# Altium schematic sheet rlink_eth.schdoc
size 209 x 297 mm; Scale: 1:1; DocumentType: Схема электрическая принципиальная; FirstReferrence: АБВГ.123456.001; PageSetup: Record=PageOptions|CenterHorizontal=False|CenterVertical=False|PrintScale=0.95|XCorrection=0.00|YCorrection=0.00|PrintKind=1|BorderSize=5000000|LeftOffset=0|BottomOffset=0|Orientation=1|PaperLength=1000|PaperWidth=1000|Scale=100|PaperSource=15|PrintQuality=600|MediaType=1|DitherType=10|PaperKind=A4|PrintScaleMode=1
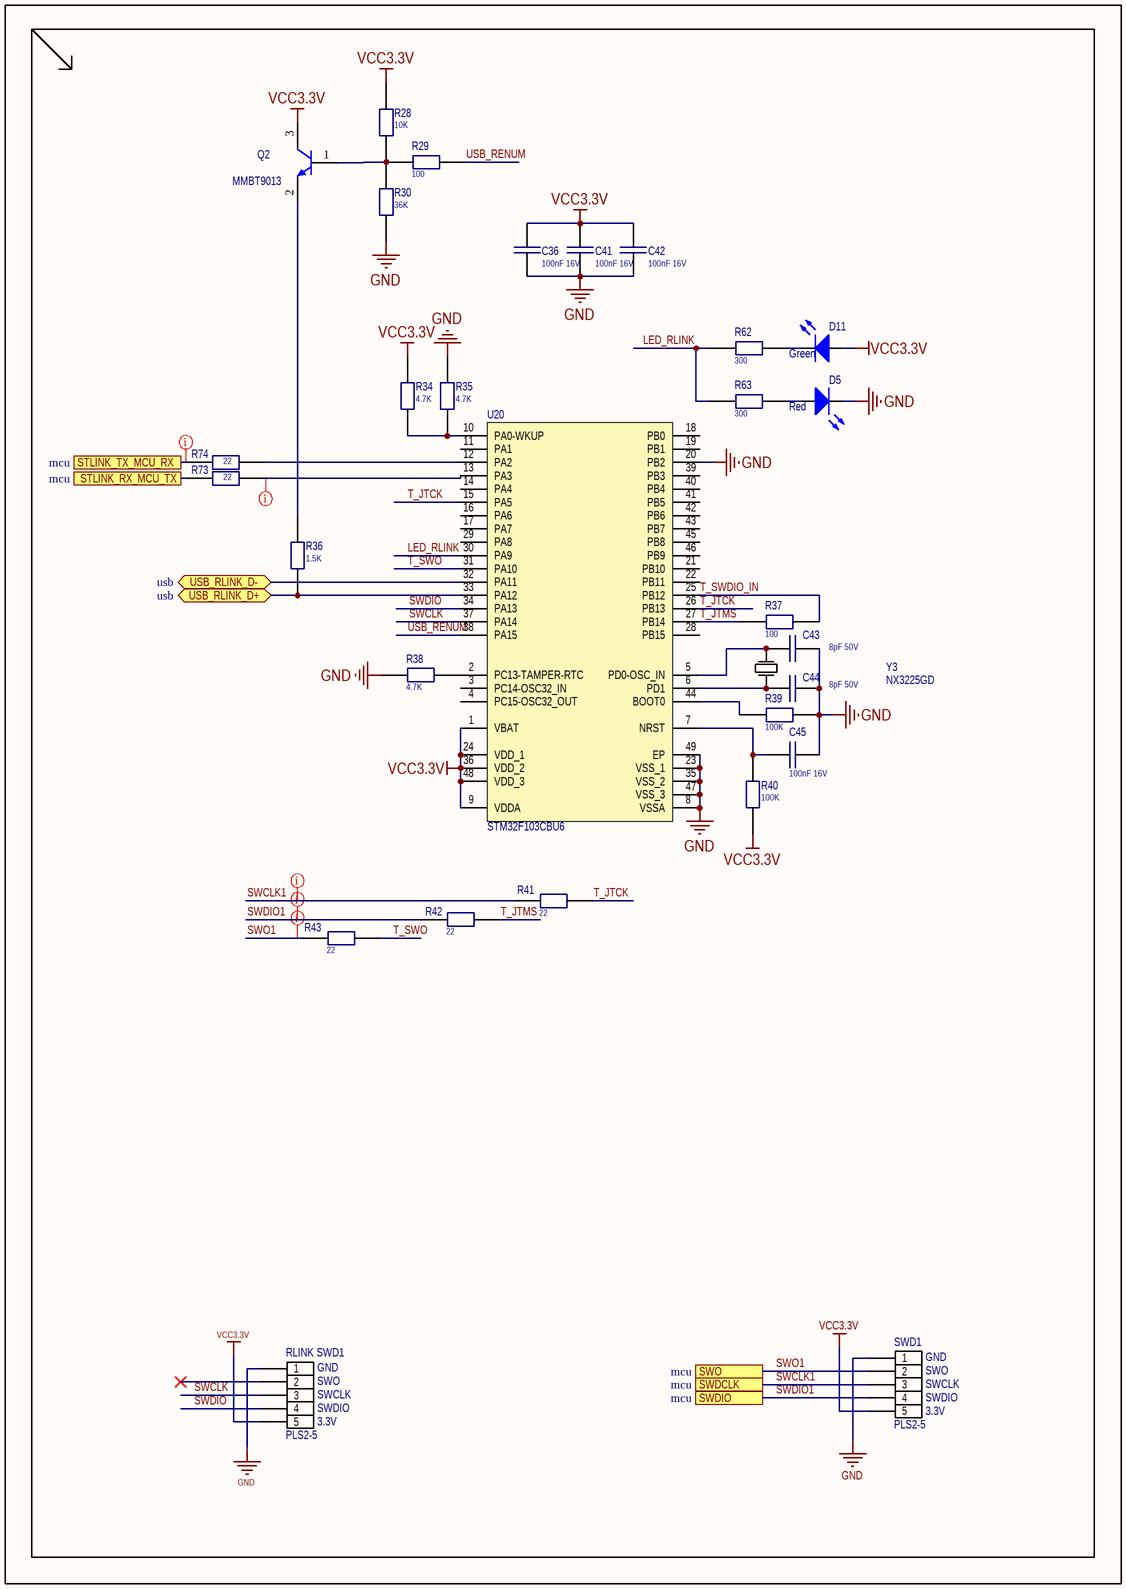
[diagram p0: rlink_eth.schdoc]

## Parts
C36  100nF 16V  [C_0402]
C41  100nF 16V  [C_0402]
C42  100nF 16V  [C_0402]
C43  8pF 50V  [C_0402]
C44  8pF 50V  [C_0402]
C45  100nF 16V  [C_0402]
D5  Red  [LED_0603]
D11  Green  [LED_0603]
Q2  MMBT9013  [SOT23]
R28  10K  [R_0402]
R29  100  [R_0402]
R30  36K  [R_0402]
R34  4.7K  [R_0402]
R35  4.7K  [R_0402]
R36  1.5K  [R_0402]
R37  100  [R_0402]
R38  4.7K  [R_0402]
R39  100K  [R_0402]
R40  100K  [R_0402]
R41  22  [R_0402]
R42  22  [R_0402]
R43  22  [R_0402]
R62  300  [R_0603]
R63  300  [R_0603]
R73  22  [R_0402]
R74  22  [R_0402]
RLINK_SWD1  PLS2-5  [PLS-5-3D]  (net tie, no BOM)
SWD1  PLS2-5  [PLS-5-3D]  (net tie, no BOM)
U20  STM32F103CBU6  [STM-UFQFPN48_M]
Y3  NX3225GD  [NX3225GD]

## Ports
STLINK_RX_MCU_TX (see mcu), STLINK_TX_MCU_RX (see mcu), SWDCLK (see mcu), SWDIO (see mcu), SWO (see mcu), USB_RLINK_D+ (bidir, see usb), USB_RLINK_D- (bidir, see usb)

## Nets
GND: C36.1 C41.1 C42.1 C43.1 C44.1 C45.1 D5.2(K) R30.2 R35.2 R38.2 R39.1 RLINK_SWD1.1 SWD1.1 U20.8(VSSA) U20.20(PB2) U20.23(VSS_1) U20.35(VSS_2) U20.47(VSS_3) U20.49(EP)
VCC3.3V: C36.2 C41.2 C42.2 D11.1(A) Q2.3(C) R28.2 R34.2 R40.2 RLINK_SWD1.5 SWD1.5 U20.1(VBAT) U20.9(VDDA) U20.24(VDD_1) U20.36(VDD_2) U20.48(VDD_3)
LED_RLINK: R62.2 R63.2 U20.30(PA9)
STLINK_RX_MCU_TX: R73.2 ; port STLINK_RX_MCU_TX
STLINK_TX_MCU_RX: R74.2 ; port STLINK_TX_MCU_RX
SWCLK: RLINK_SWD1.3 U20.37(PA14)
SWCLK1: R41.2 SWD1.3 ; port SWDCLK
SWDIO: RLINK_SWD1.4 U20.34(PA13)
SWDIO1: R42.2 SWD1.4 ; port SWDIO
SWO1: R43.2 SWD1.2 ; port SWO
T_JTCK: R41.1 U20.15(PA5) U20.26(PB13)
T_JTMS: R37.2 R42.1 U20.27(PB14)
T_SWDIO_IN: R37.1 U20.25(PB12)
T_SWO: R43.1 U20.31(PA10)
USB_RENUM: R29.1 U20.38(PA15)
USB_RLINK_D+: R36.1 U20.33(PA12) ; port USB_RLINK_D+
USB_RLINK_D-: U20.32(PA11) ; port USB_RLINK_D-
NetC43_2: C43.2 U20.5(PD0-OSC_IN) Y3.2(OSC2)
NetC44_2: C44.2 U20.6(PD1) Y3.1(OSC1)
NetC45_2: C45.2 R40.1 U20.7(NRST)
NetD5_1: D5.1(A) R63.1
NetD11_2: D11.2(K) R62.1
NetQ2_1: Q2.1(B) R28.1 R29.2 R30.1
NetQ2_2: Q2.2(E) R36.2
NetR34_1: R34.1 R35.1 U20.10(PA0-WKUP)
NetR38_1: R38.1 U20.2(PC13-TAMPER-RTC)
NetR39_2: R39.2 U20.44(BOOT0)
NetR73_1: R73.1 U20.13(PA3)
NetR74_1: R74.1 U20.12(PA2)

Not connected (* = marked no-connect by the designer): RLINK_SWD1 2*; U20 3(PC14-OSC32_IN) 4(PC15-OSC32_OUT) 11(PA1) 14(PA4) 16(PA6) 17(PA7) 18(PB0) 19(PB1) 21(PB10) 22(PB11) 28(PB15) 29(PA8) 39(PB3) 40(PB4) 41(PB5) 42(PB6) 43(PB7) 45(PB8) 46(PB9)

## Layout directives
net class UART: NetR73_1, STLINK_TX_MCU_RX
net class SWD: SWCLK1, SWDIO1, SWO1

## Notes on the sheet
- (in symbol PLS2-5) GND; SWO; SWCLK; SWDIO; 3.3V

## Library data of the parts
C36 C41 C42 C45 = C0402: Capacitor; Part: CC0402KRX7R7BB104; Alternative Part: CC0402KRX5R7BB104; JLCPCB Part: C60474
C43 C44 = C0402: Capacitor; Part: CC0402DRNPO9BN8R0; Alternative Part: *; JLCPCB Part: C327227
D5 D11 = LED_SMT_0603: LED; Part: FYLS-0603PGC; Alternative Part: KP-1608CGCK; Value: *
  D5: Color: Red; JLCPCB Part: C2986060
  D11: Color: Green; JLCPCB Part: C2994781
Q2 = NPN: NPN Bipolar Transistor; Code - JEDEC: TO-226-AA; Published: 8-Jun-2000; Revision: July-2002: Re-released for DXP Platform.; Publisher: Altium Limited; Part: MMBT9013; Alternative Part: *; JLCPCB Part: C81408
R28 = R0402: Resistor; Part: RC0402JR-0710KL; Value: 10K; Alternative Part: *; JLCPCB Part: C60489
R29 R37 = R0402: Resistor; Part: RC0402JR-07100RL; Value: 100; Alternative Part: *; JLCPCB Part: C106233
R30 = R0402: Resistor; Part: RC0402JR-0736KL; Value: 36K; Alternative Part: *; JLCPCB Part: C137879
R34 R35 R38 = R0402: Resistor; Part: RC0402JR-074K7L; Value: 4.7K; Alternative Part: *; JLCPCB Part: C105870
R36 = R0402: Resistor; Part: RC0402JR-071K5L; Value: 1.5K; Alternative Part: *; JLCPCB Part: C114451
R39 R40 = R0402: Resistor; Part: RC0402JR-07100KL; Value: 100K; Alternative Part: *; JLCPCB Part: C106234
R41-R43 R73 R74 = R0402: Resistor; Part: RC0402JR-0722RL; Value: 22; Alternative Part: *; JLCPCB Part: C93929
R62 R63 = R0603: Resistor; Part: RC0603FR-07300RL; Value: 300; JLCPCB Part: C114617
RLINK_SWD1 SWD1 = PLS2-5: Header, 5-Pin; Part: DS1021-1x5SF11-B; LatestRevisionDate: 17-Jul-2002; LatestRevisionNote: Re-released for DXP Platform.; Publisher: Altium Limited; JLCPCB Part: *
U20 = STM32F103CBU6: STM32 ARM-based 32-bit MCU Performance Line with 128 kB Flash, 20 kB Internal RAM, -40 to +85°C Temperature, 48-Pin VFQFPN, Tray; DatasheetVersion: rev13.0, Apr-2011; PackageVersion: 2011; PackageReference: VFQFPN48; PackageDescription: 48-Pin Quad Flat No-Lead, 7 x 7 x 0.9 mm Body, 0.5 mm Pitch, Exposed Pad; ComponentLink1Description: Manufacturer URL; ComponentLink1URL: http://www.st.com/; ComponentLink2Description: STM32F103 Datasheet; ComponentLink2URL: http://www.st.com/internet/com/TECHNICAL_RESOURCES/TECHNICAL_LITERATURE/DATASHEET/CD00161566.pdf; ComponentLink3Description: STM32 Family Web Page; ComponentLink3URL: www.st.com/stm32; Part: STM32F103CBU6; Alternative Part: *; JLCPCB Part: C55506
Y3 = NX3225GD: Crystal Oscillator; Part: NX3225GD-8MHZ-STD-CRA-3; Alternatve Part: *; JLCPCB Part: C889706